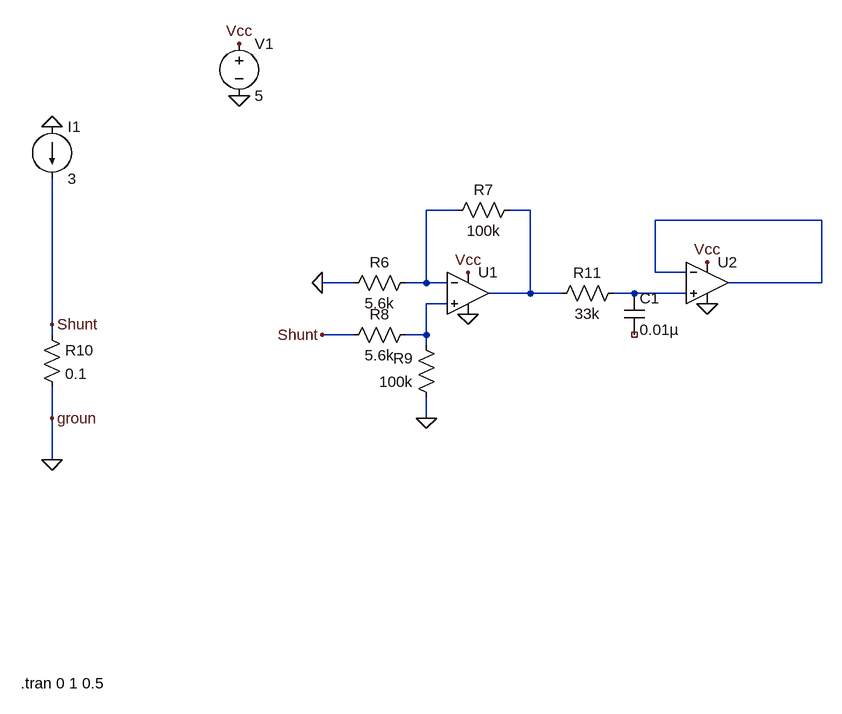
[diagram p0: schematic CurrentSense.asc]
CurrentSense.asc, the LTspice schematic file:
Version 4
SHEET 1 968 776
WIRE 144 32 96 32
WIRE 256 32 224 32
WIRE 704 48 448 48
WIRE 448 128 448 48
WIRE 496 128 448 128
WIRE -16 144 -64 144
WIRE 96 144 96 32
WIRE 96 144 64 144
WIRE 128 144 96 144
WIRE 704 144 704 48
WIRE 704 144 560 144
WIRE 256 160 256 32
WIRE 256 160 192 160
WIRE 304 160 256 160
WIRE 416 160 384 160
WIRE 496 160 416 160
WIRE 128 176 96 176
WIRE -480 208 -480 -16
WIRE -480 224 -480 208
WIRE -16 224 -64 224
WIRE 96 224 96 176
WIRE 96 224 64 224
WIRE 96 240 96 224
WIRE -480 352 -480 304
WIRE 96 352 96 320
WIRE -480 416 -480 352
FLAG 96 352 0
FLAG -480 416 0
FLAG -480 208 Shunt
FLAG -480 -96 0
FLAG -192 -144 0
FLAG -192 -224 Vcc
FLAG 160 128 Vcc
FLAG 160 192 0
FLAG -480 352 groun
FLAG -64 224 Shunt
FLAG -64 144 0
FLAG 528 112 Vcc
FLAG 528 176 0
SYMBOL Opamps\\UniversalOpamp2 160 160 R0
SYMATTR InstName U1
SYMBOL Opamps\\UniversalOpamp2 528 144 R0
SYMATTR InstName U2
SYMBOL res 80 128 R90
WINDOW 0 0 56 VBottom 2
WINDOW 3 32 56 VTop 2
SYMATTR InstName R6
SYMATTR Value 5.6k
SYMBOL res 240 16 R90
WINDOW 0 0 56 VBottom 2
WINDOW 3 32 56 VTop 2
SYMATTR InstName R7
SYMATTR Value 100k
SYMBOL res 80 208 R90
WINDOW 0 0 56 VBottom 2
WINDOW 3 32 56 VTop 2
SYMATTR InstName R8
SYMATTR Value 5.6k
SYMBOL res 112 336 R180
WINDOW 0 36 76 Left 2
WINDOW 3 36 40 Left 2
SYMATTR InstName R9
SYMATTR Value 100k
SYMBOL res -496 208 R0
SYMATTR InstName R10
SYMATTR Value 0.1
SYMBOL current -480 -96 R0
WINDOW 123 0 0 Left 0
WINDOW 39 0 0 Left 0
SYMATTR InstName I1
SYMATTR Value 3
SYMBOL voltage -192 -240 R0
WINDOW 123 0 0 Left 0
WINDOW 39 0 0 Left 0
SYMATTR InstName V1
SYMATTR Value 5
SYMBOL cap 400 160 R0
SYMATTR InstName C1
SYMATTR Value 0.01µ
SYMBOL res 400 144 R90
WINDOW 0 0 56 VBottom 2
WINDOW 3 32 56 VTop 2
SYMATTR InstName R11
SYMATTR Value 33k
TEXT -528 760 Left 2 !.tran 0 1 0.5

The netlist it stands for:
* CurrentSense.asc
XU1 N005 N001 Vcc 0 N002 level.2 Avol=1Meg GBW=10Meg Slew=10Meg ilimit=25m rail=0 Vos=0 phimargin=45 en=0 enk=0 in=0 ink=0 Rin=500Meg  ; pins IN+ IN- V+ V- OUT
XU2 N004 N003 Vcc 0 N003 level.2 Avol=1Meg GBW=10Meg Slew=10Meg ilimit=25m rail=0 Vos=0 phimargin=45 en=0 enk=0 in=0 ink=0 Rin=500Meg  ; pins IN+ IN- V+ V- OUT
R6 N001 0 5.6k
R7 N002 N001 100k
R8 N005 Shunt 5.6k
R9 0 N005 100k
R10 Shunt 0 0.1
I1 0 Shunt 3
V1 Vcc 0 5
C1 N004 NC_01 0.01µ
R11 N004 N002 33k
.tran 0 1 0.5
.lib UniversalOpamps2.sub
.backanno
.end